# Altium schematic sheet TPS63020电源模块.SchDoc
size A4
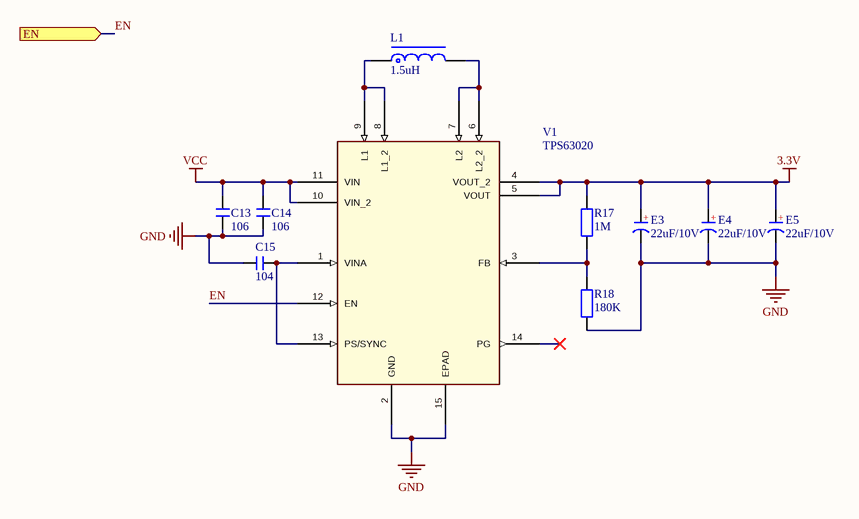
[diagram p0: TPS63020电源模块.SchDoc]

## Parts
C13  106  [C 0603_L]
C14  106  [C 0603_L]
C15  104  [C 0603_L]
E3  22uF/10V  [CD A(3216)]
E4  22uF/10V  [CD A(3216)]
E5  22uF/10V  [CD A(3216)]
L1  1.5uH  [SMD,4.75x4.45x2mm]
R17  1M  [R 0603_L]
R18  180K  [R 0603_L]
V1  TPS63020  [VSON - 14]

## Ports
EN (in)

## Nets
3.3V: E3.1(A) E4.1(A) E5.1(A) R17.2 V1.4(VOUT_2) V1.5(VOUT)
GND: C13.2 C14.2 C15.1 E3.2(K) E4.2(K) E5.2(K) R18.1 V1.2(GND) V1.15(EPAD)
VCC: C13.1 C14.1 V1.10(VIN_2) V1.11(VIN)
EN: V1.12(EN) ; port EN
NetC15_2: C15.2 V1.1(VINA) V1.13(PS/SYNC)
NetL1_1: L1.1 V1.8(L1_2) V1.9(L1)
NetL1_2: L1.2 V1.6(L2_2) V1.7(L2)
NetR17_1: R17.1 R18.2 V1.3(FB)

Not connected (* = marked no-connect by the designer): V1 14(PG)*

## Notes on the sheet
- (in symbol C-CD) +

## Library data of the parts
C13-C15 = C: 无极性贴片电容; 版权归属: 黎明电子style; BOM名称: 无极性贴片电容; 学习资源: https://lmdzstyle.taobao.com/
E3-E5 = C-CD: 贴片钽电容; 版权归属: 黎明电子style; BOM名称: 贴片钽电容; 学习资源: https://lmdzstyle.taobao.com/
L1 = L-CD: 贴片功率电感; BOM名称: 功率电感; 版权归属: 黎明电子style; 学习资源: https://lmdzstyle.taobao.com/
R17 R18 = R: 贴片电阻; 版权归属: 黎明电子style; BOM名称: 贴片电阻; 学习资源: https://lmdzstyle.taobao.com/
V1 = TPS63020: 单电感器降压/升压转换器   High Efficiency Single Inductor Buck-Boost Converter with 4A Switch